# Altium schematic sheet Buck_Converter.SchDoc
size A4; SheetNumber: 3; SheetTotal: 13
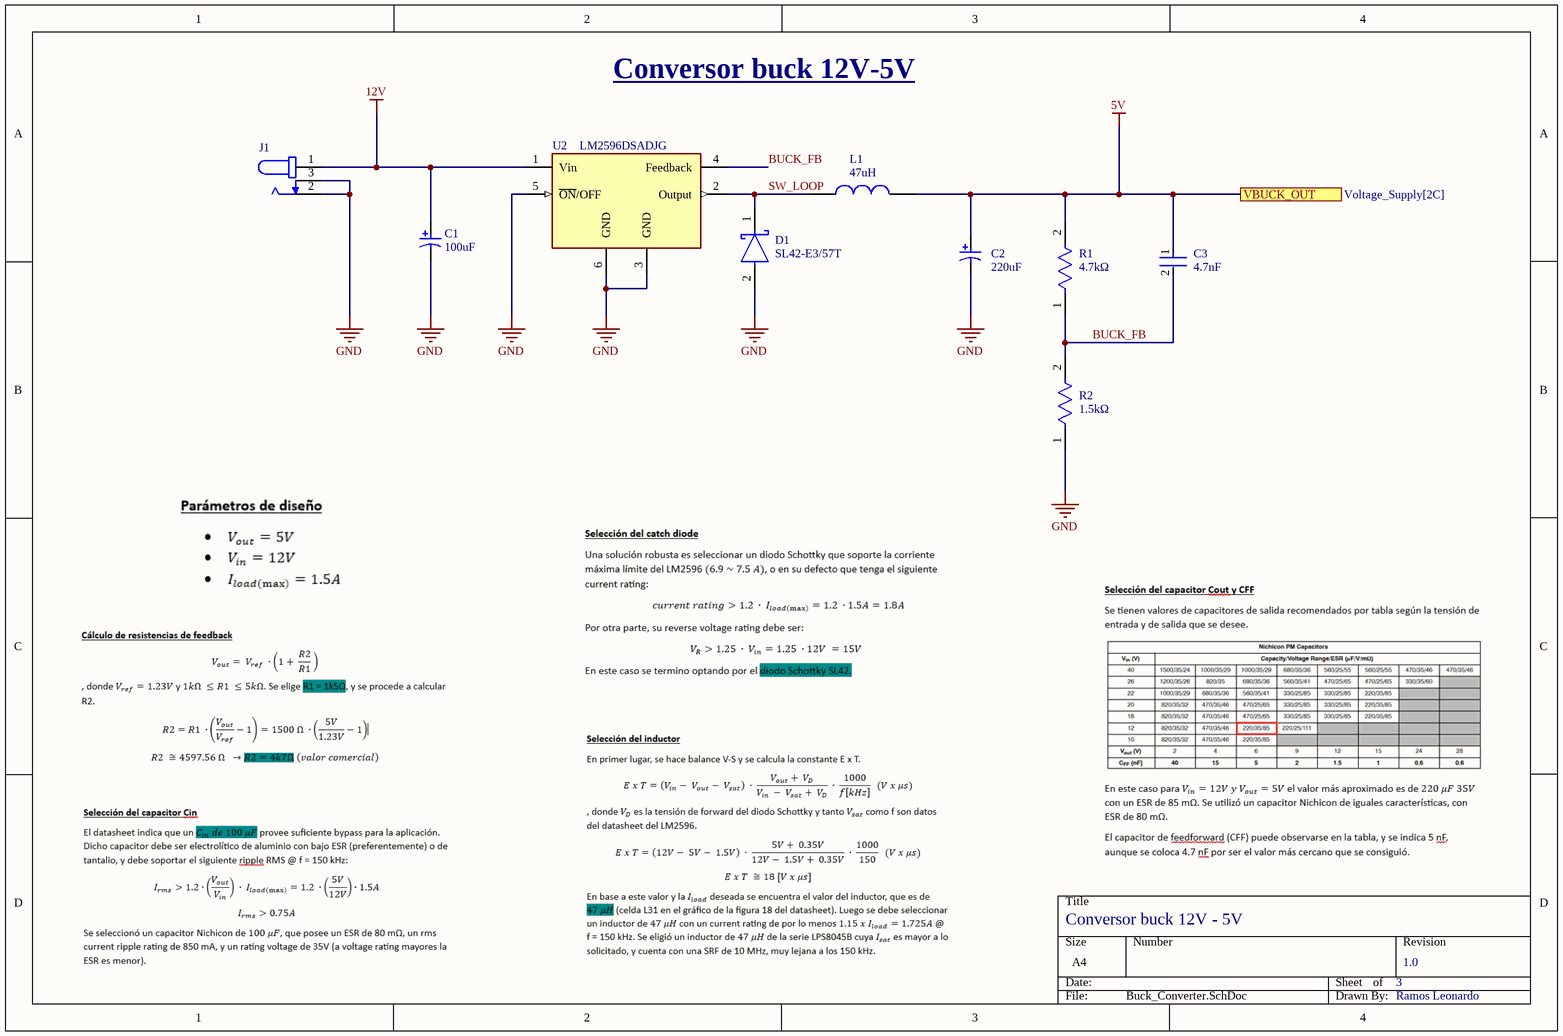
[diagram p0: Buck_Converter.SchDoc]

## Parts
C1  Capacitance: 100uF  [NIC-UCL1V101MNL1GS_L]  (hidden comment: UCL1V101MNL1GS)
C2  Capacitance: 220uF  [NIC-UCL1V101MNL1GS_L]  (hidden comment: UCL1V101MNL1GS)
C3  Capacitance: 4.7nF  [FP-GRM21B-0_1-IPC_B]  (hidden comment: GRM21B7U1A104JA01L)
D1  SL42-E3/57T  [FP-95402-MFG]
J1  DCJ200-10-A-XX-K_REVA  [GCT_DCJ200-10-A-XX-K_REVA]  (value not drawn)
L1  value 47uH  [LPS8045B_Series_Power_inductor]
R1  Resistance: 4.7kΩ  [FP-CRCW0805-e3-IPC_B]  (hidden comment: CRCW08054K70JNEA)
R2  Resistance: 1.5kΩ  [FP-CRCW0805-e3-IPC_B]  (hidden comment: CRCW08054K70JNEA)
U2  LM2596DSADJG  [FP-936A-02-MFG]

## Ports
VBUCK_OUT (see Voltage_Supply[2C])

## Nets
5V: C2.1 C3.1 L1.2 R1.2 ; port VBUCK_OUT
12V: C1.1 J1.1 U2.1(Vin)
GND: C1.2 C2.2 D1.2(A) J1.2 J1.3 R2.1 U2.3(GND) U2.5(~{ON}/OFF) U2.6(GND)
BUCK_FB: C3.2 R1.1 R2.2 U2.4(Feedback)
SW_LOOP: D1.1(C) L1.1 U2.2(Output)

## Notes on the sheet
- Conversor buck 12V-5V
- Conversor buck 12V - 5V
- 3
- 1.0
- Ramos Leonardo

## Library data of the parts
C1 = CMP-2000-07344-1: Aluminum Electrolytic Capacitor, 100 uF, 35 V, 20%, -55 to 105 degC, 2-Pin SMD, RoHS, Tape and Reel; Manufacturer: Nichicon; Dissipation Factor DF: 0.12; Case Diameter: 8mm; Ripple Current: 850mA; Type: AluminumElectrolyticCapacitors,ChipType,LowImpedance; Case Height: 8.3mm; Leakage Current: 3uA; Voltage Rating DC: 35V; Load Life: 2000h; Case Length: 10mm; Series: CL; Minimum Operating Temperature: -55C; Datasheet URL: http://datasheet.octopart.com/UCL1V101MNL1GS-Nichicon-datasheet-41194108.pdf; Manufacturer URL: http://www.nichicon.co.jp/english/; Maximum Operating Temperature: +105C; Package Reference: UCL1V101MNL1GS; Operating Temperature Range: -55Cto+105C; Brand: Nichicon; Package Description: 2-Pin Surface Mount Device, Body 8.3 x 8.3 mm, Height 10.8 mm; RoHS: Details; Voltage Rating: 35V; Dimensions: 8mmDia.x10mmLx8.3mmH; Termination Style: SMD/SMT; Datasheet Version: 01/2015; Packaging: Reel; Mounting Technology: SurfaceMount; Product Category: AluminumElectrolyticCapacitors-SMD; Factory Pack Quantity: 500; Product: LowImpedanceElectrolyticCapacitors; Tolerance: 20%
C2 = CMP-2000-07344-1: Aluminum Electrolytic Capacitor, 220 uF, 35 V, 20%, -55 to 105 degC, 2-Pin SMD, RoHS, Tape and Reel (80 mOhm); Manufacturer: Nichicon; Dissipation Factor DF: 0.12; Case Diameter: 8mm; Ripple Current: 850mA; Type: AluminumElectrolyticCapacitors,ChipType,LowImpedance; Case Height: 8.3mm; Leakage Current: 3uA; Voltage Rating DC: 35V; Load Life: 2000h; Case Length: 10mm; Series: CL; Minimum Operating Temperature: -55C; Datasheet URL: http://datasheet.octopart.com/UCL1V101MNL1GS-Nichicon-datasheet-41194108.pdf; Manufacturer URL: http://www.nichicon.co.jp/english/; Maximum Operating Temperature: +105C; Package Reference: UCL1V101MNL1GS; Operating Temperature Range: -55Cto+105C; Brand: Nichicon; Package Description: 2-Pin Surface Mount Device, Body 8.3 x 8.3 mm, Height 10.8 mm; RoHS: Details; Voltage Rating: 35V; Dimensions: 8mmDia.x10mmLx8.3mmH; Termination Style: SMD/SMT; Datasheet Version: 01/2015; Packaging: Reel; Mounting Technology: SurfaceMount; Product Category: AluminumElectrolyticCapacitors-SMD; Factory Pack Quantity: 500; Product: LowImpedanceElectrolyticCapacitors; Tolerance: 20%
C3 = CMP-06035-037063-1: Chip Multilayer Ceramic Capacitors for General Purpose, 0805, 4.7nF, U2J, -750ppm/°C, 5%, 10V; Depth: 1.25mm; Voltage Rating (DC): 10V; Voltage Rating: 10V; Length: 2mm; Max Operating Temperature: 125°C; Thickness: 0.053inch; Dielectric: U2J; Termination: SMD/SMT; Package Quantity: 3000; Packaging: Tape and Reel; Case Code (Metric): 2012; Tolerance: 5%; Case Code (Imperial): 0805; Case/Package: 0805; Mount: Surface Mount; Width: 0.049inch; Height: 1.25mm; Radiation Hardening: No; Min Operating Temperature: -55°C
D1 = CMP-00030-39552820-1: SL42-E3/57T Rectifier Diode, Schottky, 1 Phase, 1 Element, 4A, 20V V(RRM), Silicon, DO-214AB; Max Junction Temperature (Tj): 125°C; Max Reverse Leakage Current: 500µA; Max Surge Current: 150A; Forward Voltage: 470mV; Element Configuration: Single; Polarity: Standard; Max Reverse Voltage (DC): 20V; Radiation Hardening: No; Packaging: Cut Tape; Mount: Surface Mount; Reverse Voltage: 20V; Peak Reverse Current: 500µA; Lead Free: Lead Free; Max Operating Temperature: 125°C; Max Forward Surge Current (Ifsm): 150A; Peak Non-Repetitive Surge Current: 150A; Height: 2.62mm; Min Operating Temperature: -55°C; RoHS: Compliant; Forward Current: 4A; REACH SVHC: Unknown; Schedule B: 8541100080, 8541100080; Current Rating: 4A; Voltage Rating (DC): 20V; Max Repetitive Reverse Voltage (Vrrm): 20V; Number of Pins: 2; Output Current: 4A; NexarPartId: 39552820; Case/Package: SMC; Average Rectified Current: 4A
J1 = DCJ200-10-A-XX-K_REVA: Power Barrel Connector Jack 2.05mm ID (0.081), 5.50mm OD (0.217) Through Hole, Right Angle; MF: Global Connector Technology; MP: DCJ200-10-A-K1-K; SnapEDA_Link: https://www.snapeda.com/parts/DCJ200-10-A-K1-K/Global+Connector+Technology/view-part/?ref=snap; Package: None; Value: *; Check_prices: https://www.snapeda.com/parts/DCJ200-10-A-K1-K/Global+Connector+Technology/view-part/?ref=eda
L1 = L: Inductor genérico; Manufacturer: *; Manufacturer part number: *; Tolerance: *; Package size: *; Voltage rating: *
R1 = CMP-2001-03967-2: RES Thick Film, 1.5kΩ, 5%, 0.125W, 200ppm/°C, 0805; Power Rating: 125mW; Voltage Rating: 150V; Radiation Hardening: No; Case Code (Imperial): 0805; Military Standard: Not; Contact Plating: Tin; Weight: 0.000194oz; Mount: Surface Mount; Termination: SMD/SMT; Packaging: Tape and Reel; Min Operating Temperature: -55°C; Width: 1.25mm; Tolerance: 5%; Height: 0.45mm; Depth: 1.25mm; Length: 2mm; Temperature Coefficient: 200ppm/°C; Case Code (Metric): 2012; Package Quantity: 5000; Max Operating Temperature: 155°C; Case/Package: 0805; Composition: Thick Film
R2 = CMP-2001-03967-2: RES Thick Film, 4.7kΩ, 5%, 0.125W, 200ppm/°C, 0805; Power Rating: 125mW; Voltage Rating: 150V; Radiation Hardening: No; Case Code (Imperial): 0805; Military Standard: Not; Contact Plating: Tin; Weight: 0.000194oz; Mount: Surface Mount; Termination: SMD/SMT; Packaging: Tape and Reel; Min Operating Temperature: -55°C; Width: 1.25mm; Tolerance: 5%; Height: 0.45mm; Depth: 1.25mm; Length: 2mm; Temperature Coefficient: 200ppm/°C; Case Code (Metric): 2012; Package Quantity: 5000; Max Operating Temperature: 155°C; Case/Package: 0805; Composition: Thick Film
U2 = CMP-07129-000001-1: IC REG MULT CONFG ADJ 3A D2PAK-5; Manufacturer: ON Semiconductor; Max Duty Cycle: 95%; Nominal Supply Current: 5mA; Standoff Height: 0mm; Min Supply Voltage: 4.5V; Output Voltage: 1.23-37V; Negative Voltage Available: true; Number Of Outputs: 1; Max Junction Temp: +125°C; Output Type: AdjustableProgrammable; Max Supply Voltage: 40V; Switching Topology: Boost,Buck,Buck-Boost; Switching Frequency: 150Hz; Output Current: 3A; Device Class L1: Integrated Circuits (ICs); Height: 4.826mm; Manufacturer Part Number: LM2596DSADJG; ComponentLink2URL: https://www.onsemi.com/pub/Collateral/LM2596-D.PDF; Device Class L3: Voltage Regulators - Switching; Octopart: https://octopart.com/lm2596dsadjg-on+semiconductor-12437034; Mouser Description: Voltage Regulators - Switching Regulators 3A BUCK SWCH 150KHZ; Automotive: No; RoHS: TRUE; Temperature Range High: +125°C; ComponentLink2Description: Datasheet; Device Class L2: Power Management ICs; Digikey Description: IC REG MULT CONFG ADJ 3A D2PAK-5; Temperature Range Low: -40°C; Footprint Url: https://www.onsemi.com/pub/Collateral/936A-02.PDF; Lead Free: Yes; Temperature: -40°C to +125°C; Package: 936A-02; Category: IC